# EAGLE design TuringMixExpander (EAGLE 7.4.0)
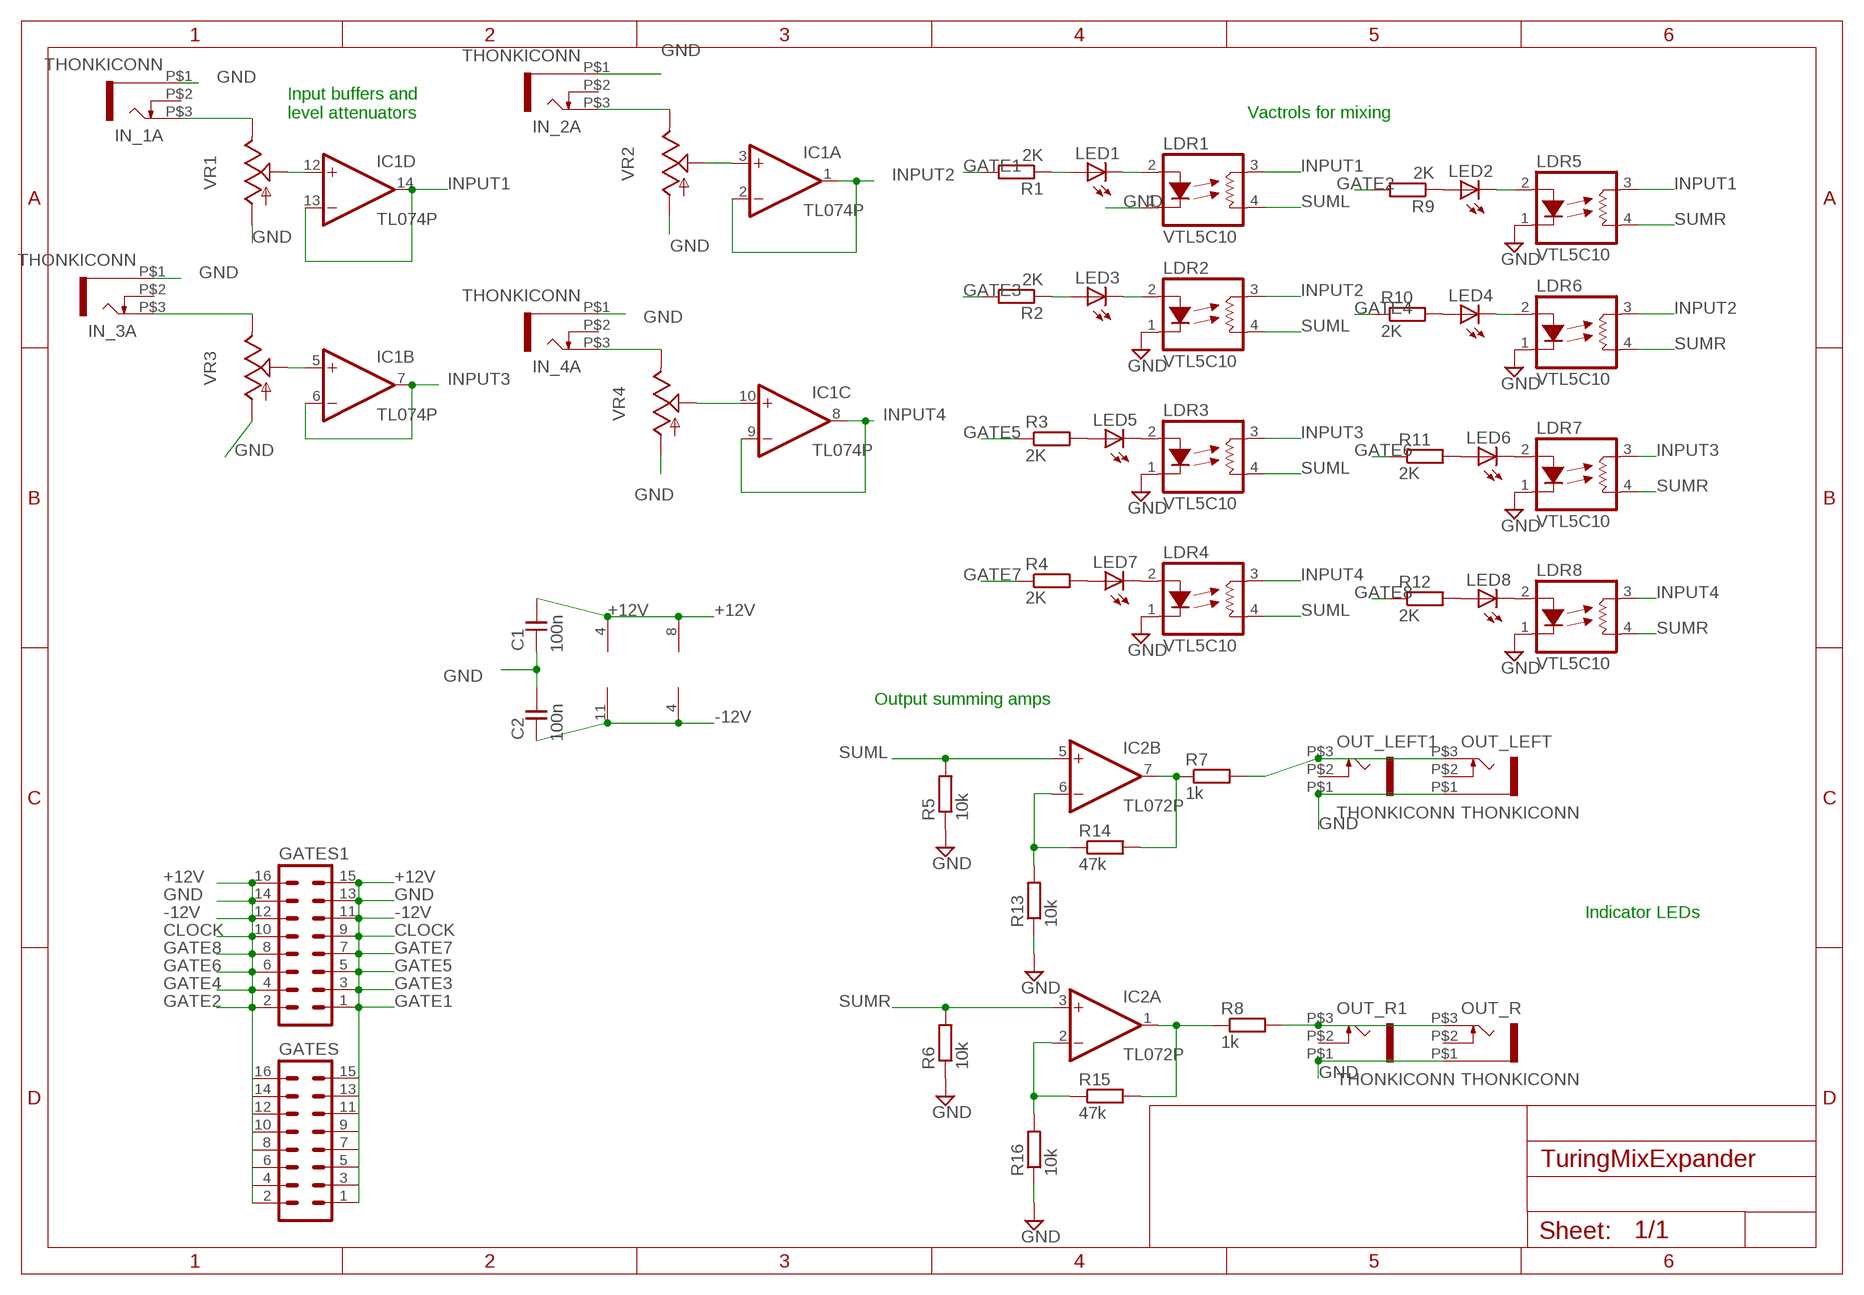
[diagram p0: schematic, sheet 1]

## Parts
C1  100n  C-EU050-024X044  [C050-024X044]
C2  100n  C-EU050-024X044  [C050-024X044]
GATES  MA08-2  [MA08-2]
GATES1  MA08-2  [MA08-2]
IC1  TL074P  [DIL14]
IC2  TL072P  [DIL08]
IN_1A  THONKICONN  [THONKICONN]
IN_2A  THONKICONN  [THONKICONN]
IN_3A  THONKICONN  [THONKICONN]
IN_4A  THONKICONN  [THONKICONN]
LDR1  VTL5C10  [VTL5C]
LDR2  VTL5C10  [VTL5C]
LDR3  VTL5C10  [VTL5C]
LDR4  VTL5C10  [VTL5C]
LDR5  VTL5C10  [VTL5C]
LDR6  VTL5C10  [VTL5C]
LDR7  VTL5C10  [VTL5C]
LDR8  VTL5C10  [VTL5C]
LED1  LED3MM  [LED3MM]
LED2  LED3MM  [LED3MM]
LED3  LED3MM  [LED3MM]
LED4  LED3MM  [LED3MM]
LED5  LED3MM  [LED3MM]
LED6  LED3MM  [LED3MM]
LED7  LED3MM  [LED3MM]
LED8  LED3MM  [LED3MM]
OUT_LEFT  THONKICONN  [THONKICONN]
OUT_LEFT1  THONKICONN  [THONKICONN]
OUT_R  THONKICONN  [THONKICONN]
OUT_R1  THONKICONN  [THONKICONN]
R1  2K  R-EU_0207/7  [0207/7]
R2  2K  R-EU_0207/7  [0207/7]
R3  2K  R-EU_0207/7  [0207/7]
R4  2K  R-EU_0207/7  [0207/7]
R5  10k  R-EU_0207/7  [0207/7]
R6  10k  R-EU_0207/7  [0207/7]
R7  1k  R-EU_0207/7  [0207/7]
R8  1k  R-EU_0207/7  [0207/7]
R9  2K  R-EU_0207/7  [0207/7]
R10  2K  R-EU_0207/7  [0207/7]
R11  2K  R-EU_0207/7  [0207/7]
R12  2K  R-EU_0207/7  [0207/7]
R13  10k  R-EU_0207/7  [0207/7]
R14  47k  R-EU_0207/7  [0207/7]
R15  47k  R-EU_0207/7  [0207/7]
R16  10k  R-EU_0207/7  [0207/7]
VR1  ALPHA-9MMF2A  [EVUF]
VR2  ALPHA-9MMF2A  [EVUF]
VR3  ALPHA-9MMF2A  [EVUF]
VR4  ALPHA-9MMF2A  [EVUF]

## Nets
+12V [power]: C1.1 GATES1.15 GATES1.16 GATES.15 GATES.16 IC1.4(P:V+) IC2.8(P:V+)
-12V [power]: C2.2 GATES1.11 GATES1.12 GATES.11 GATES.12 IC1.11(P:V-) IC2.4(P:V-)
CLOCK: GATES1.9 GATES1.10 GATES.9 GATES.10
GATE1: GATES1.1 GATES.1 R1.2
GATE2: GATES1.2 GATES.2 R9.2
GATE3: GATES1.3 GATES.3 R2.2
GATE4: GATES1.4 GATES.4 R10.1
GATE5: GATES1.5 GATES.5 R3.1
GATE6: GATES1.6 GATES.6 R11.1
GATE7: GATES1.7 GATES.7 R4.1
GATE8: GATES1.8 GATES.8 R12.1
GND [ground]: C1.2 C2.1 GATES1.13 GATES1.14 GATES.13 GATES.14 IN_1A.P$1 IN_2A.P$1 IN_3A.P$1 IN_4A.P$1 LDR1.1(LED-) LDR2.1(LED-) LDR3.1(LED-) LDR4.1(LED-) LDR5.1(LED-) LDR6.1(LED-) LDR7.1(LED-) LDR8.1(LED-) OUT_LEFT1.P$1 OUT_LEFT.P$1 OUT_R1.P$1 OUT_R.P$1 R5.1 R6.1 R13.1 R16.1 VR1.1(A) VR2.1(A) VR3.1(A) VR4.1(A)
INPUT1: IC1.13(D:-IN) IC1.14(D:OUT) LDR1.3(RES1) LDR5.3(RES1)
INPUT2: IC1.1(A:OUT) IC1.2(A:-IN) LDR2.3(RES1) LDR6.3(RES1)
INPUT3: IC1.6(B:-IN) IC1.7(B:OUT) LDR3.3(RES1) LDR7.3(RES1)
INPUT4: IC1.8(C:OUT) IC1.9(C:-IN) LDR4.3(RES1) LDR8.3(RES1)
N$1: IN_1A.P$3 VR1.3(E)
N$2: IC1.12(D:+IN) VR1.2(S)
N$3: IN_2A.P$3 VR2.3(E)
N$4: IC1.3(A:+IN) VR2.2(S)
N$5: IC2.7(B:OUT) R7.1 R14.2
N$6: OUT_R1.P$3 OUT_R.P$3 R8.2
N$7: IC2.6(B:-IN) R13.2 R14.1
N$10: IC2.2(A:-IN) R15.1 R16.2
N$11: IC1.5(B:+IN) VR3.2(S)
N$12: IN_3A.P$3 VR3.3(E)
N$13: IN_4A.P$3 VR4.3(E)
N$14: LDR1.2(LED+) LED1.K(C)
N$15: LDR2.2(LED+) LED3.K(C)
N$16: LDR3.2(LED+) LED5.K(C)
N$17: LDR4.2(LED+) LED7.K(C)
N$18: LDR5.2(LED+) LED2.K(C)
N$19: LDR6.2(LED+) LED4.K(C)
N$20: LDR7.2(LED+) LED6.K(C)
N$21: LDR8.2(LED+) LED8.K(C)
N$22: OUT_LEFT1.P$3 OUT_LEFT.P$3 R7.2
N$23: IC1.10(C:+IN) VR4.2(S)
N$24: IC2.1(A:OUT) R8.1 R15.2
N$25: LED1.A R1.1
N$26: LED3.A R2.1
N$27: LED5.A R3.2
N$28: LED7.A R4.2
N$29: LED2.A R9.1
N$30: LED4.A R10.2
N$31: LED6.A R11.2
N$32: LED8.A R12.2
SUML: IC2.5(B:+IN) LDR1.4(RES2) LDR2.4(RES2) LDR3.4(RES2) LDR4.4(RES2) R5.2
SUMR: IC2.3(A:+IN) LDR5.4(RES2) LDR6.4(RES2) LDR7.4(RES2) LDR8.4(RES2) R6.2
Unconnected: IN_1A.P$2 IN_2A.P$2 IN_3A.P$2 IN_4A.P$2 OUT_LEFT1.P$2 OUT_LEFT.P$2 OUT_R1.P$2 OUT_R.P$2

## Notes on the sheet
- Input buffers and 
  level attenuators
- Vactrols for mixing
- Output summing amps
- Indicator LEDs

## Library data of the parts
C1 C2 = TomW:C-EU: CAPACITOR, European symbol
GATES GATES1 = con-lstb:MA08-2: PIN HEADER; OC_FARNELL: unknown; OC_NEWARK: unknown
IC1 = linear:TL074: OP AMP
IC2 = TomW:TL072: OP AMP
IN_1A IN_2A IN_3A IN_4A OUT_LEFT OUT_LEFT1 OUT_R OUT_R1 = TomW:THONKICONN
LDR1-LDR8 = TomW:VTL5C*: Low Cost Axial Vactrols Source: www.perkinelmer.com/opto ... vtl5c9_c10.pdf
LED1-LED8 = TomW:LED: LED OSRAM: - CHIPLED LG R971, LG N971, LY N971, LG Q971, LY Q971, LO R971, LY R971 LH N974, LH R974 LS Q976, LO Q976, LY Q976 LO Q996 - Hyper CHIPLED LW Q18S LB Q993, LB Q99A, LB R99A - SideLED LS A670, LO A670, LY A670, LG A670, LP A670 LB A673, LV A673, LT A673, LW A673 LH A674 LY A675 LS A676, LA A676, LO A676, LY A676, LW A676 LS A679, LY A679, LG A679 - Hyper Micro SIDELED® LS Y876, LA Y876, LO Y876, LY Y876 LT Y87S - SmartLED LW L88C, LW L88S LB L89C, LB L89S, LG L890 LS L89K, LO L89K, LY L89K LS L896, LA L896, LO L896, LY L896 - TOPLED LS T670, LO T670, LY T670, LG T670, LP T670 LSG T670, LSP T670, LSY T670, LOP T670, LYG T670 LG T671, LOG T671, LSG T671 LB T673, LV T673, LT T673, LW T673 LH T674 LS T676, LA T676, LO T676, LY T676, LB T676, LH T676, LSB T676, LW T676 LB T67C, LV T67C, LT T67C, LS T67K, LO T67K, LY T67K, LW E67C LS E67B, LA E67B, LO E67B, LY E67B, LB E67C, LV E67C, LT E67C LW T67C LS T679, LY T679, LG T679 LS T770, LO T770, LY T770, LG T770, LP T770 LB T773, LV T773, LT T773, LW T773 LH T774 LS E675, LA E675, LY E675, LS T675 LS T776, LA T776, LO T776, LY T776, LB T776 LHGB T686 LT T68C, LB T68C - Hyper Mini TOPLED® LB M676 - Mini TOPLED Santana® LG M470 LS M47K, LO M47K, LY M47K Source: http://www.osram.convergy.de LUXEON: - LUMILED® LXK2-PW12-R00, LXK2-PW12-S00, LXK2-PW14-U00, LXK2-PW14-V00 LXK2-PM12-R00, LXK2-PM12-S00, LXK2-PM14-U00 LXK2-PE12-Q00, LXK2-PE12-R00, LXK2-PE12-S00, LXK2-PE14-T00, LXK2-PE14-U00 LXK2-PB12-K00, LXK2-PB12-L00, LXK2-PB12-M00, LXK2-PB14-N00, LXK2-PB14-P00, LXK2-PB14-Q00 LXK2-PR12-L00, LXK2-PR12-M00, LXK2-PR14-Q00, LXK2-PR14-R00 LXK2-PD12-Q00, LXK2-PD12-R00, LXK2-PD12-S00 LXK2-PH12-R00, LXK2-PH12-S00 LXK2-PL12-P00, LXK2-PL12-Q00, LXK2-PL12-R00 Source: www.luxeon.com KINGBRIGHT: KA-3528ASYC Source: www.kingbright.com
R1-R16 = TomW:R-EU_: RESISTOR, European symbol
VR1-VR4 = TomW:ALPHA-9MM: 9 mm Square Rotary Potentiometers Source: Panasonic

## Net classes
0 default: width 0.254 mm
1 power: width 0.406 mm
2 ground: width 0.406 mm

## Board
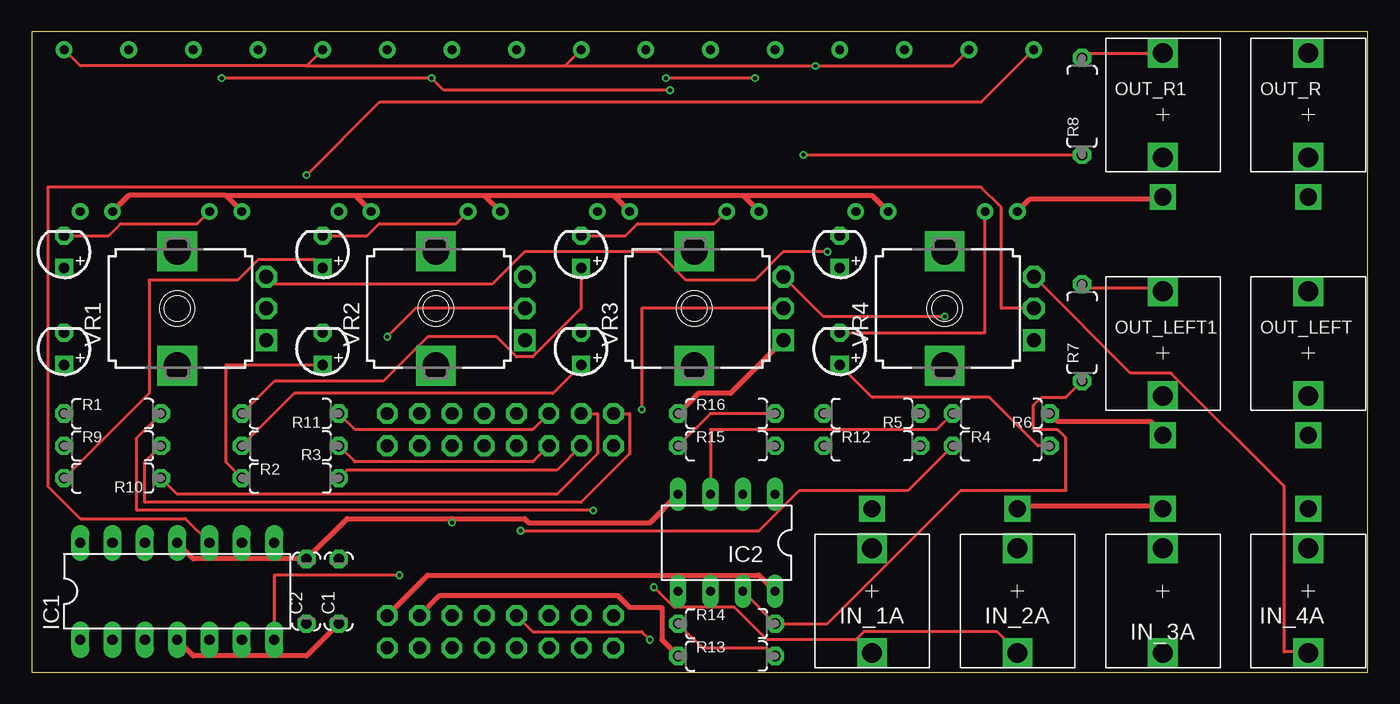
[diagram p1: board, top side]
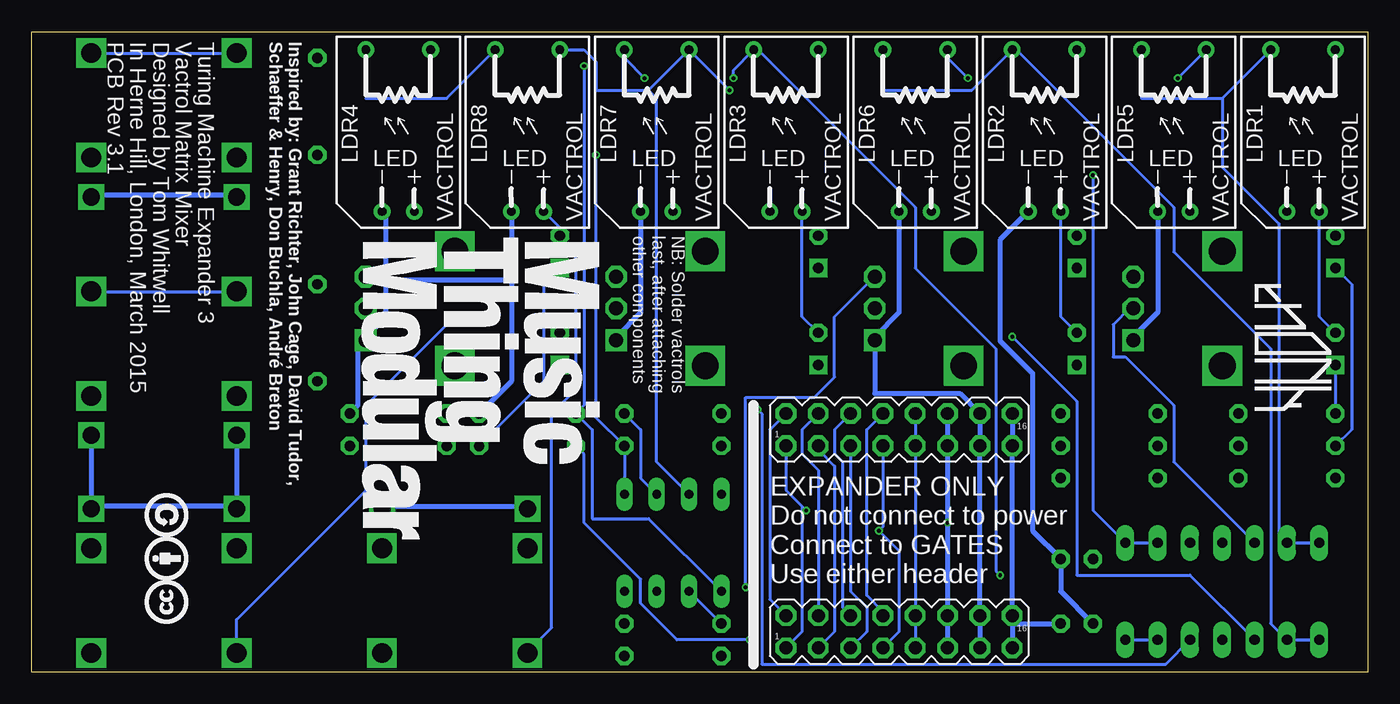
[diagram p2: board, bottom side, seen from below]

Size 105 x 50.31 mm. Coordinates in mm from the lower left corner, seen from the top.
Outline: 0,50.31 0,0 105,0 105,50.31 0,50.31
Copper layers (1*2*15*16): Top 0.035mm / dielectric 0.2mm / Route2 0.0175mm / dielectric 1.1mm / Route15 0.0175mm / dielectric 0.2mm / Bottom 0.035mm
Design rules "MT design rules rev2": minimum track width 6mil, minimum drill 12mil, track to track 12mil, track to pad 12mil, pad to pad 10mil, via to via 10mil, smd to smd 0mil, copper to edge 15mil, drill to drill 13mil, minimum pad ring 12mil, minimum via ring 6mil, stop-mask expansion 2mil, vias tented up to drill 25mil, thermal gap 10mil

### Footprints (pad centres in the part's own frame; a part is rotated, then mirrored left to right if it is on the bottom)
C050-024X044 = drill 0.813 octagon: 1 -2.54,0; 2 2.54,0
MA08-2 = drill 1.016 octagon: 1 -8.89,-1.27; 2 -8.89,1.27; 3 -6.35,-1.27; 4 -6.35,1.27; 5 -3.81,-1.27; 6 -3.81,1.27; 7 -1.27,-1.27; 8 -1.27,1.27; 9 1.27,-1.27; 10 1.27,1.27; 11 3.81,-1.27; 12 3.81,1.27; 13 6.35,-1.27; 14 6.35,1.27; 15 8.89,-1.27; 16 8.89,1.27
DIL14 = drill 0.813 long: 1 -7.62,-3.81; 2 -5.08,-3.81; 3 -2.54,-3.81; 4 0,-3.81; 5 2.54,-3.81; 6 5.08,-3.81; 7 7.62,-3.81; 8 7.62,3.81; 9 5.08,3.81; 10 2.54,3.81; 11 0,3.81; 12 -2.54,3.81; 13 -5.08,3.81; 14 -7.62,3.81
DIL08 = drill 0.7 long: 1 -3.81,-3.81; 2 -1.27,-3.81; 3 1.27,-3.81; 4 3.81,-3.81; 5 3.81,3.81; 6 1.27,3.81; 7 -1.27,3.81; 8 -3.81,3.81
THONKICONN = drill 1.35 square: P$1 0,-6.48 | drill 1.55 square: P$2 0,-3.38; P$3 0,4.84
VTL5C = drill 0.7 pad 1.3: 1 -6.35,1.27; 2 -6.35,-1.27; 3 6.35,2.54; 4 6.35,-2.54
LED3MM = drill 0.813 square: A -1.27,0 | drill 0.813 octagon: K 1.27,0
0207/7 = drill 0.813 octagon: 1 -3.81,0; 2 3.81,0
EVUF = drill 1.1 pad 1.676 square: 1 -2.5,-7 | drill 1.1 pad 1.676 octagon: 2 0,-7; 3 2.5,-7 | drill 2.1 pad 2.8 square: M1 4.5,0; M2 -4.5,0

### Placement (x,y rotation side)
C1  24.13,6.35 90 top
C2  21.59,6.35 90 top
GATES  36.83,19.05 0 bottom
GATES1  36.83,3.17 0 bottom
IC1  11.43,6.35 0 top
IC2  54.61,10.16 180 top
IN_1A  66.04,6.35 180 top
IN_2A  77.47,6.35 180 top
IN_3A  88.9,6.35 180 top
IN_4A  100.33,6.35 180 top
LDR1  5.08,42.55 90 bottom
LDR2  25.4,42.55 90 bottom
LDR3  45.72,42.55 90 bottom
LDR4  76.2,42.55 90 bottom
LDR5  15.24,42.55 90 bottom
LDR6  35.56,42.55 90 bottom
LDR7  55.88,42.55 90 bottom
LDR8  66.04,42.55 90 bottom
LED1  2.54,25.4 90 top
LED2  2.54,33.02 90 top
LED3  22.86,25.4 90 top
LED4  22.86,33.02 90 top
LED5  43.18,25.4 90 top
LED6  43.18,33.02 90 top
LED7  63.5,25.4 90 top
LED8  63.5,33.02 90 top
OUT_LEFT  100.33,25.08 0 top
OUT_LEFT1  88.9,25.08 0 top
OUT_R  100.33,43.81 0 top
OUT_R1  88.9,43.81 0 top
R1  6.35,20.32 0 top
R2  20.32,15.24 0 top
R3  20.32,17.78 180 top
R4  76.2,17.78 0 top
R5  66.04,20.32 180 top
R6  76.2,20.32 180 top
R7  82.55,26.67 90 top
R8  82.55,44.45 90 top
R9  6.35,17.78 0 top
R10  6.35,15.24 180 top
R11  20.32,20.32 180 top
R12  66.04,17.78 0 top
R13  54.61,1.27 0 top
R14  54.61,3.81 0 top
R15  54.61,17.78 0 top
R16  54.61,20.32 0 top
U$1  [MTM_2CM]  80.01,34.29 270 bottom
U$2  [CC_1CM_SCREENPRINT]  92.71,3.81 90 bottom
U$3  [THONK_1CM_SCREENPRINT]  8.89,30.48 270 bottom
VR1  11.43,28.57 90 top
VR2  31.75,28.57 90 top
VR3  52.07,28.57 90 top
VR4  71.75,28.57 90 top

### Tracks (layer width: path | path; a pad name or v marks a point on that pad's centre or on a via)
+12V
  Top 0.406: IC1.4 12.7,1.27 21.59,1.27 C1.1 | IC2.8 57.15,7.62 31.11,7.62 GATES1.16
  Bottom 0.406: GATES.16 GATES.15 GATES1.16 27.94,3.81 | 27.94,3.81 GATES1.15 | 27.94,3.81 C1.1
-12V  (via drill 0.3)
  Top 0.406: IC2.4 48.58,11.75 39.05,11.75 38.73,12.06 33.02,12.06 | 33.02,12.06 24.77,12.06 C2.2 12.7,8.89 IC1.11 | 33.02,12.06 v33.02,11.75
  Bottom 0.406: GATES1.11 GATES1.12 v33.02,11.75 GATES.11 GATES.12
CLOCK
  Bottom 0.254: GATES1.9 GATES1.10 GATES.9 GATES.10
GATE1  (via drill 0.3)
  Top 0.254: R1.2 8.26,18.41 8.26,12.7 v44.13,12.7
  Bottom 0.254: 44.45,13.02 45.72,14.29 GATES.1 | 44.45,13.02 v44.13,12.7 | GATES1.1 44.45,3.17 44.45,13.02
GATE2
  Top 0.254: R9.2 8.89,16.51 8.89,13.34 43.18,13.34 46.99,17.14 46.99,20.32 GATES.2
  Bottom 0.254: GATES1.2 46.99,5.71 46.99,19.05 GATES.2
GATE3
  Top 0.254: R2.2 24.77,15.88 41.27,15.88 GATES.3
  Bottom 0.254: GATES1.3 41.91,3.17 41.91,16.19 43.18,17.46 GATES.3
GATE4
  Top 0.254: R10.1 11.43,13.97 41.27,13.97 44.45,17.14 44.45,20.32 GATES.4
  Bottom 0.254: GATES1.4 43.18,15.88 44.45,17.14 44.45,19.05 GATES.4
GATE5
  Top 0.254: R3.1 25.4,16.51 39.37,16.51 GATES.5
  Bottom 0.254: GATES1.5 39.37,3.17 39.37,5.08 40.64,6.35 GATES.5
GATE6
  Top 0.254: R11.1 25.4,19.05 39.37,19.05 GATES.6
  Bottom 0.254: GATES1.6 41.27,5.08 41.27,16.51 41.91,17.14 41.91,19.05 GATES.6
GATE7  (via drill 0.3)
  Top 0.254: R4.1 68.9,14.29 60.33,14.29 57.15,11.11 v38.42,11.11
  Bottom 0.254: GATES.7 38.1,11.43 v38.42,11.11 36.83,9.53 36.83,3.17 GATES1.7
GATE8  (via drill 0.3)
  Top 0.254: v48.58,2.54 47.94,3.17 39.37,3.17 GATES1.8
  Bottom 0.254: R12.1 61.59,17.14 61.59,11.75 57.15,7.3 57.15,5.4 54.29,2.54 v48.58,2.54 | GATES.8 39.37,19.05 39.37,6.03 38.1,4.76 GATES1.8
GND
  Top 0.406: LDR4.1 78.42,37.15 88.9,37.15 OUT_R1.P$1 | R6.1 80.64,19.68 87.95,19.68 88.9,18.73 OUT_LEFT1.P$1 | IN_2A.P$1 77.47,13.02 88.9,13.02 IN_3A.P$1 | R13.1 49.53,2.54 49.53,5.08 46.99,5.08 46.04,6.03 32.07,6.03 GATES1.14 | R16.1 52.39,21.91 54.93,21.91 59.05,26.04 VR3.1 | LDR1.1 7.62,37.47 15.24,37.47 | LDR5.1 15.24,37.47 | 25.4,37.47 LDR2.1 | 15.24,37.47 25.4,37.47 | 35.56,37.47 LDR6.1 | 25.4,37.47 35.56,37.47 | 45.72,37.47 LDR3.1 | 35.56,37.47 45.72,37.47 | 55.88,37.47 LDR7.1 | 45.72,37.47 55.88,37.47 | LDR8.1 66.04,37.47 55.88,37.47
  Bottom 0.406: OUT_R.P$1 100.33,37.47 88.9,37.47 OUT_R1.P$1 | IN_1A.P$1 66.04,13.02 77.47,13.02 IN_2A.P$1 | OUT_LEFT.P$1 100.33,13.02 | R6.1 79.38,20.95 79.38,25.72 79.06,26.04 VR4.1 78.74,26.35 77.15,27.94 77.15,30.8 | OUT_LEFT1.P$1 88.9,13.02 | 88.9,13.02 100.33,13.02 | 100.33,13.02 IN_4A.P$1 | 88.9,13.02 IN_3A.P$1 | LDR4.1 77.15,35.88 77.15,30.8 | GATES1.13 GATES1.14 GATES.13 GATES.14 32.07,21.91 38.73,21.91 38.73,26.04 VR2.1 38.73,26.35 36.83,28.26 LDR6.1 | C2.1 24.13,6.35 C1.2 26.35,11.11 26.35,23.5 28.89,26.04 28.89,33.97 LDR2.1 | R5.1 67.31,22.86 67.31,30.8 | LDR8.1 67.31,30.8 | LDR5.1 16.51,28.26 18.41,26.35 VR1.1 | LDR7.1 57.15,28.26 59.05,26.35 VR3.1 | 67.31,30.8 77.15,30.8
INPUT1
  Bottom 0.254: IC1.14 IC1.13 6.99,10.79 6.99,35.24 11.43,39.69 11.43,45.09 | 11.43,45.09 LDR1.3 | 11.43,45.09 17.78,45.09 LDR5.3
INPUT2
  Bottom 0.254: IC1.1 IC1.2 7.62,3.81 7.62,25.4 15.24,33.02 15.24,36.51 27.62,48.9 LDR2.3 31.11,45.72 38.1,45.72 LDR6.3
INPUT3  (via drill 0.3)
  Top 0.254: v56.83,46.67 v49.85,46.67 | IC1.7 19.05,7.62 v28.89,7.62
  Bottom 0.254: IC1.7 IC1.6 | v49.85,46.67 49.85,47.31 LDR3.3 47.94,48.9 35.56,36.51 35.56,31.75 29.21,25.4 29.21,7.94 v28.89,7.62 | v56.83,46.67 58.42,48.26 LDR7.3
INPUT4  (via drill 0.3)
  Top 0.254: v21.59,39.05 27.3,44.77 74.61,44.77 LDR4.3
  Bottom 0.254: IC1.9 IC1.8 21.59,12.7 v21.59,39.05 | LDR8.3 72.39,45.09 78.74,45.09 LDR4.3
N$1  (via drill 0.3)
  Top 0.254: v62.55,33.02 59.05,33.02 56.83,30.8 51.44,30.8 49.21,33.02 38.73,33.02 36.2,30.48 19.05,30.48 18.73,30.8 VR1.3
  Bottom 0.254: v62.55,33.02 62.23,32.7 62.23,22.23 64.14,20.32 64.14,3.49 66.04,1.59 IN_1A.P$3
N$2
  Bottom 0.254: IC1.12 15.24,16.51 15.24,20.95 19.05,24.77 20,24.77 20,27.3 18.73,28.57 VR1.2
N$3  (via drill 0.3)
  Top 0.254: v48.9,6.67 50.48,5.08 55.24,5.08 57.78,2.54 64.77,2.54 65.41,3.17 75.88,3.17 77.47,1.59 IN_2A.P$3
  Bottom 0.254: v48.9,6.67 48.9,21.59 43.5,21.59 41.91,23.18 41.91,27.94 39.05,30.8 VR2.3
N$4  (via drill 0.3)
  Top 0.254: v27.94,26.35 30.16,28.57 VR2.2
  Bottom 0.254: IC1.3 13.97,7.62 22.86,7.62 22.86,21.27 v27.94,26.35
N$5
  Top 0.254: IC2.7 R14.2 62.55,3.81 73.03,14.29 81.28,14.29 81.28,18.41 80.64,19.05 78.74,19.05 78.74,20.95 79.38,21.59 81.28,21.59 R7.1
N$6
  Top 0.254: R8.2 82.87,48.58 88.9,48.58 OUT_R1.P$3
  Bottom 0.254: OUT_R.P$3 100.33,48.58 88.9,48.58 OUT_R1.P$3
N$7
  Top 0.254: R13.2 57.78,1.91 52.7,1.91 R14.1
  Bottom 0.254: R14.1 IC2.6
N$10
  Top 0.254: R15.1 53.34,20.32 R16.2
  Bottom 0.254: IC2.2 57.15,15.24 57.15,19.05 R16.2
N$11  (via drill 0.3)
  Top 0.254: v47.94,20.64 47.94,28.57 VR3.2
  Bottom 0.254: IC1.5 15.88,0.64 47.62,0.64 47.62,20.32 v47.94,20.64
N$12  (via drill 0.3)
  Top 0.254: v71.75,27.94 62.23,27.94 59.37,30.8 VR3.3
  Bottom 0.254: v71.75,27.94 78.74,20.95 78.74,14.29 88.9,4.13 IN_3A.P$3
N$13
  Top 0.254: VR4.3 79.06,30.8 86.36,23.5 89.53,23.5 98.42,14.61 98.42,1.59 100.33,1.59 IN_4A.P$3
N$14
  Bottom 0.254: LDR1.2 3.81,27.94 LED1.K
N$15
  Bottom 0.254: LDR2.2 24.13,27.94 LED3.K
N$16
  Bottom 0.254: LDR3.2 44.45,27.94 LED5.K
N$17
  Top 0.254: LDR4.2 74.93,26.67 LED7.K
N$18
  Top 0.254: LDR5.2 13.02,35.24 6.99,35.24 6.03,34.29 LED2.K
N$19
  Top 0.254: LDR6.2 33.34,35.24 27.3,35.24 26.35,34.29 LED4.K
N$20
  Top 0.254: LDR7.2 53.66,35.24 47.62,35.24 46.67,34.29 LED6.K
N$21
  Bottom 0.254: LDR8.2 63.5,34.92 LED8.K
N$22
  Top 0.254: R7.2 82.87,30.16 88.9,30.16 OUT_LEFT1.P$3
  Bottom 0.254: OUT_LEFT.P$3 100.33,29.84 88.9,29.84 OUT_LEFT1.P$3
N$23
  Top 0.254: IC1.10 12.06,12.06 3.81,12.06 1.27,14.61 1.27,38.1 74.61,38.1 76.2,36.51 76.2,28.57 VR4.2
N$24  (via drill 0.3)
  Top 0.254: v60.64,40.64 R8.1
  Bottom 0.254: IC2.1 R15.2 60.64,20 v60.64,40.64
N$25
  Bottom 0.254: LED1.A R1.1
N$26
  Top 0.254: R2.1 15.24,16.51 15.24,24.13 LED3.A
N$27
  Top 0.254: R3.2 20.64,21.91 40.96,21.91 LED5.A
N$28
  Top 0.254: LED7.A 66.04,21.59 75.25,21.59 79.06,17.78 R4.2
N$29
  Bottom 0.254: R9.1 1.27,19.05 1.27,30.48 LED2.A
N$30
  Top 0.254: R10.2 9.21,21.91 9.21,30.8 16.19,30.8 17.78,32.38 22.23,32.38 LED4.A
N$31
  Top 0.254: R11.2 19.05,22.86 27.62,22.86 31.11,26.35 36.51,26.35 38.1,24.77 39.37,24.77 43.18,28.57 LED6.A
N$32
  Bottom 0.254: R12.2 64.77,22.86 64.77,30.48 LED8.A
SUML  (via drill 0.3)
  Top 0.254: LDR1.4 3.81,47.62 21.59,47.62 | LDR2.4 21.59,47.62 | 41.91,47.62 LDR3.4 | 21.59,47.62 41.91,47.62 | LDR4.4 72.39,47.62 v61.59,47.62 41.91,47.62
  Bottom 0.254: IC2.5 56.52,12.06 60.96,12.06 60.96,19.05 R5.2 61.59,20.95 v61.59,47.62
SUMR  (via drill 0.3)
  Top 0.254: v14.92,46.67 v31.43,46.67 32.38,45.72 v50.16,45.72 | IC2.3 53.34,19.05 71.12,19.05 R6.2
  Bottom 0.254: v14.92,46.67 LDR5.4 | v31.43,46.67 33.02,48.26 LDR6.4 | 56.52,45.72 LDR7.4 v50.16,45.72 | 56.52,45.72 60.64,45.72 60.64,47.94 61.59,48.9 LDR8.4 | 56.52,45.72 55.88,45.09 55.88,16.51 IC2.3

### Text on the board
bPlace: Inspired by: Grant Richter, John Cage, David Tudor, / Schaeffer & Henry, Don Buchla, André Breton | Turing Machine Expander 3 / Vactrol Matrix Mixer / Designed by Tom Whitwell / In Herne Hill, London, March 2015 / PCB Rev 3.1 | NB: Solder vactrols / last, after attaching / other components | EXPANDER ONLY / Do not connect to power / Connect to GATES / Use either header